# EAGLE schematic arduino_uno_shield (EAGLE 7.1.0)
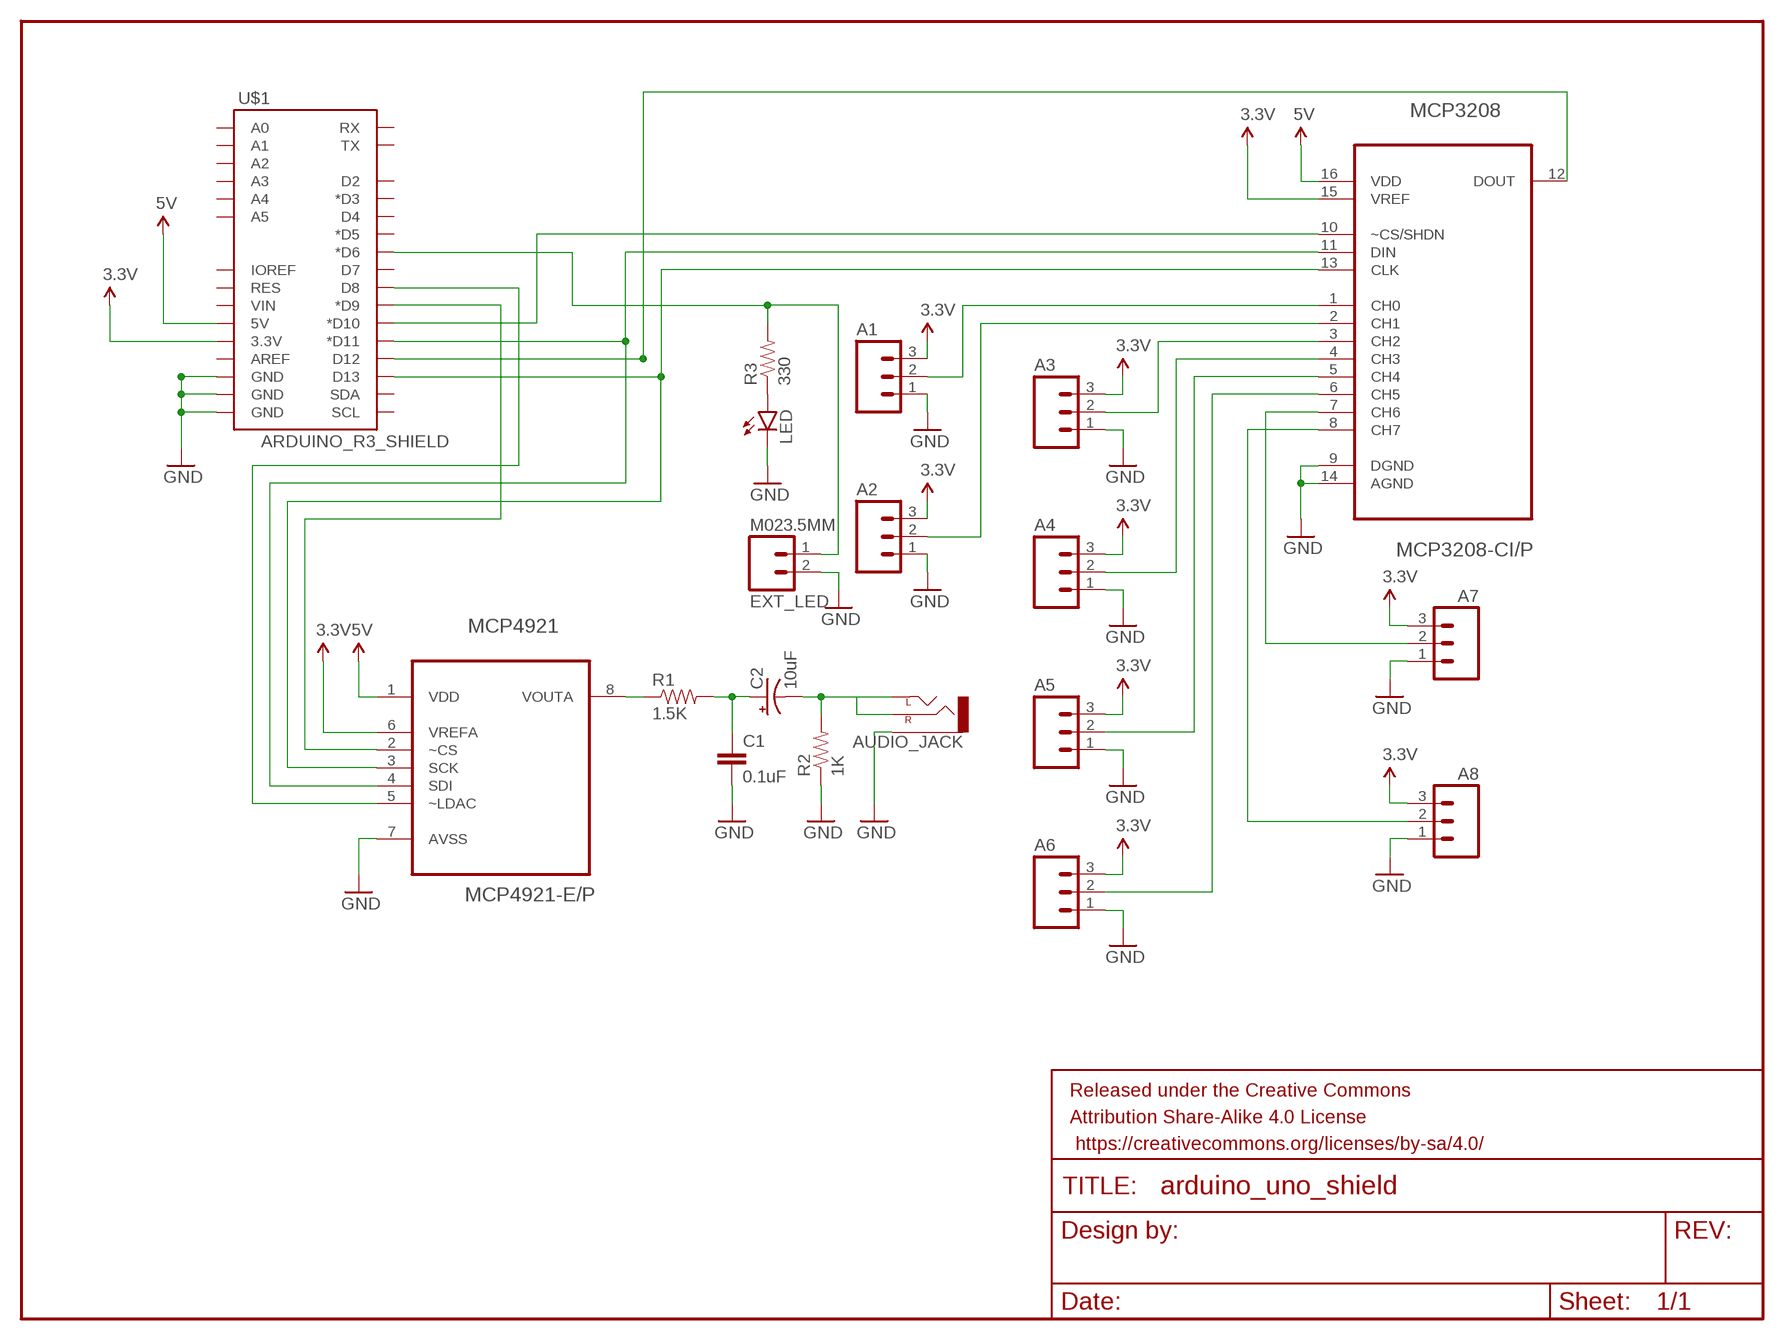
[diagram p0: schematic, sheet 1]

## Parts
A1  M03PTH  [1X03]
A2  M03PTH  [1X03]
A3  M03PTH  [1X03]
A4  M03PTH  [1X03]
A5  M03PTH  [1X03]
A6  M03PTH  [1X03]
A7  M03PTH  [1X03]
A8  M03PTH  [1X03]
AUDIO_JACK  AUDIO-JACKPTH  [AUDIO-JACK]
C1  0.1uF  CAPPTH  [CAP-PTH-SMALL]
C2  10uF  CAP_POLPTH2  [CPOL-RADIAL-10UF-25V]
EXT_LED  M023.5MM  [SCREWTERMINAL-3.5MM-2]
FRAME3  FRAME-LETTER  [CREATIVE_COMMONS]
LED  LED5MM  [LED5MM]
MCP3208  MCP3208-CI/P  [DIP254P762X432-16]
MCP4921  MCP4921-E/P  [DIP254P762X432-8]
R1  1.5K  RESISTORPTH-1/4W  [AXIAL-0.4]
R2  1K  RESISTORPTH-1/4W  [AXIAL-0.4]
R3  330  RESISTORPTH-1/4W  [AXIAL-0.4]
U$1  ARDUINO_R3_SHIELD  [UNO_R3_SHIELD]

## Nets
3.3V: A1.3 A2.3 A3.3 A4.3 A5.3 A6.3 A7.3 A8.3 MCP3208.15(VREF) MCP4921.6(VREFA) U$1.3.3V
5V: MCP3208.16(VDD) MCP4921.1(VDD) U$1.5V
AUD: A1.2 MCP3208.1(CH0)
CS_ADC: MCP3208.10(~CS/SHDN) U$1.D10(*D10)
CS_DAC: MCP4921.2(~CS) U$1.D9(*D9)
GND: A1.1 A2.1 A3.1 A4.1 A5.1 A6.1 A7.1 A8.1 AUDIO_JACK.SLEEVE C1.2 EXT_LED.2 LED.K(C) MCP3208.9(DGND) MCP3208.14(AGND) MCP4921.7(AVSS) R2.P$1 U$1.GND@0(GND) U$1.GND@1(GND) U$1.GND@2(GND)
N$1: A5.2 MCP3208.5(CH4)
N$2: A2.2 MCP3208.2(CH1)
N$3: MCP4921.8(VOUTA) R1.P$1
N$8: C1.1 C2.1(+) R1.P$2
N$9: AUDIO_JACK.RING(RIGHT) AUDIO_JACK.TIP(LEFT) C2.2(-) R2.P$2
N$10: LED.A R3.P$1
N$11: MCP4921.5(~LDAC) U$1.D8
N$12: EXT_LED.1 R3.P$2 U$1.D6(*D6)
N$14: A3.2 MCP3208.3(CH2)
N$15: A4.2 MCP3208.4(CH3)
N$16: A6.2 MCP3208.6(CH5)
N$17: A7.2 MCP3208.7(CH6)
N$18: A8.2 MCP3208.8(CH7)
SPI_CLK: MCP3208.13(CLK) MCP4921.3(SCK) U$1.D13
SPI_MISO: MCP3208.12(DOUT) U$1.D12
SPI_MOSI: MCP3208.11(DIN) MCP4921.4(SDI) U$1.D11(*D11)
Unconnected: U$1.A0 U$1.A1 U$1.A2 U$1.A3 U$1.A4 U$1.A5 U$1.AREF U$1.D2 U$1.D3(*D3) U$1.D4 U$1.D5(*D5) U$1.D7 U$1.IOREF U$1.RES U$1.RX U$1.SCL U$1.SDA U$1.TX U$1.VIN

## Library data of the parts
A1-A8 = SparkFun-Connectors:M03: Header 3 Standard 3-pin 0.1" header. Use with straight break away headers (SKU : PRT-00116), right angle break away headers (PRT-00553), swiss pins (PRT-00743), machine pins (PRT-00117), and female headers (PRT-00115). Molex polarized connector foot print use with SKU : PRT-08232 with associated crimp pins and housings.
AUDIO_JACK = SparkFun-Connectors:AUDIO-JACK: 3.5mm Audio Jack Simple 3.5mm common PCB mount audio jack. SKU: PRT-08032
C1 = SparkFun-Passives:CAP: Capacitor Standard 0603 ceramic capacitor, and 0.1" leaded capacitor.
C2 = SparkFun-Passives:CAP_POL: Capacitor Polarized These are standard SMD and PTH capacitors. Normally 10uF, 47uF, and 100uF in electrolytic and tantalum varieties. Always verify the external diameter of the through hole cap, it varies with capacity, voltage, and manufacturer. The EIA devices should be standard.
EXT_LED = SparkFun-Connectors:M02: Standard 2-pin 0.1" header. Use with - straight break away headers ( PRT-00116) - right angle break away headers (PRT-00553) - swiss pins (PRT-00743) - machine pins (PRT-00117) - female headers (PRT-00115) Molex polarized connector foot print use with: PRT-08233 with associated crimp pins and housings. 2.54_SCREWTERM for use with PRT-10571. 3.5mm Screw Terminal footprints for PRT-08084 5mm Screw Terminal footprints for use with PRT-08433
FRAME3 = SparkFun-Aesthetics:FRAME-LETTER: Schematic Frame Standard 8.5x11 US Letter frame
LED = SparkFun-LED:LED: LEDs Standard schematic elements and footprints for 5mm, 3mm, 1206, and 0603 sized LEDs. 5mm - Spark Fun Electronics SKU : COM-00529 (and others)
MCP3208 = Microchip_By_element14_Batch_1:MCP3208-CI/P: A/D Converters; MPN: MCP3208-CI/P; OC_FARNELL: 1084269; OC_NEWARK: 58K1815; PACKAGE: DIP-16; SUPPLIER: Microchip
MCP4921 = Microchip_By_element14_Batch_1:MCP4921-E/P: DAC; MPN: MCP4921-E/P; OC_FARNELL: 1332112; OC_NEWARK: 08J8743; PACKAGE: DIP-8; SUPPLIER: Microchip
R1-R3 = SparkFun-Passives:RESISTOR: Resistor Basic schematic elements and footprints for 0603, 1206, and PTH resistors.
U$1 = SparkFun-Boards:ARDUINO_R3_SHIELD: Shield form compatible with the Arduino Uno R3.